# Altium schematic sheet depth sensor.SchDoc
size A4; SheetNumber: 1; SheetTotal: 1
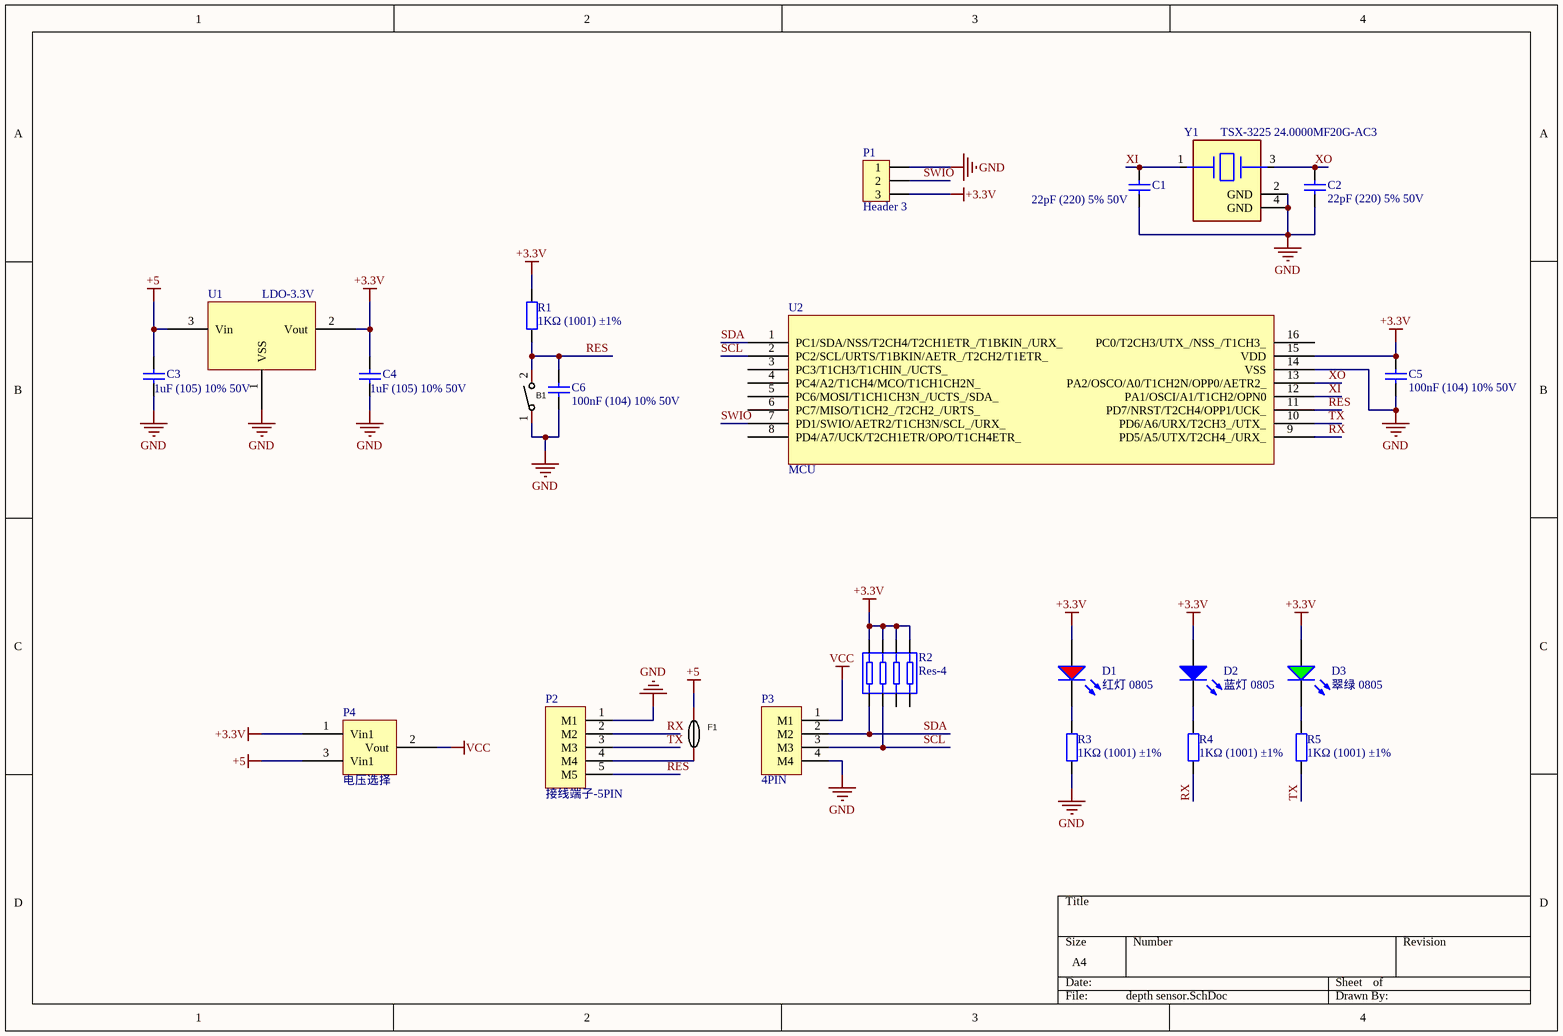
[diagram p0: depth sensor.SchDoc]

## Parts
B1  TS342A2P-WZ  [SW-SMD_L4.0-W2.9-LS5.0]  (value not drawn)
C1  22pF (220) 5% 50V  [0603_C]
C2  22pF (220) 5% 50V  [0603_C]
C3  1uF (105) 10% 50V  [0603_C]
C4  1uF (105) 10% 50V  [0603_C]
C5  100nF (104) 10% 50V  [0603_C]
C6  100nF (104) 10% 50V  [0603_C]
D1  红灯 0805  [0805_LED_S1]
D2  蓝灯 0805  [0805_LED_S1]
D3  翠绿 0805  [0805_LED_S1]
F1  SMD0805-110  [F0805]  (value not drawn)
P1  Header 3  [Header 3]
P2  接线端子-5PIN  [PH2.0-WS-5P]
P3  4PIN  [MX1.25WS-4PIN]
P4  电压选择  [change]
R1  1KΩ (1001) ±1%  [0603_R]
R2  Res-4  [res-4]
R3  1KΩ (1001) ±1%  [0603_R]
R4  1KΩ (1001) ±1%  [0603_R]
R5  1KΩ (1001) ±1%  [0603_R]
U1  LDO-3.3V  [SOT95P290X110-3N]
U2  MCU  [TSOP127P600X155-16N]
Y1  TSX-3225 24.0000MF20G-AC3  [FP-TSX-3225-MFG]

## Nets
+3.3V: C4.2 C5.2 D1.A D2.A D3.A P1.3 P4.1(Vin1) R1.2 R2.5 R2.6 R2.7 R2.8 U1.2(Vout) U2.15(VDD)
+5: C3.2 F1.2 P4.3(Vin1) U1.3(Vin)
GND: B1.1 C1.1 C2.1 C3.1 C4.1 C5.1 C6.1 P1.1 P2.1(M1) P3.4(M4) R3.1 U1.1(VSS) U2.14(VSS) Y1.2(GND) Y1.4(GND)
VCC: P3.1(M1) P4.2(Vout)
RES: B1.2 C6.2 P2.5(M5) R1.1 U2.11(PD7/NRST/T2CH4/OPP1/UCK_)
RX: P2.2(M2) R4.1 U2.9(PD5/A5/UTX/T2CH4_/URX_)
SCL: P3.3(M3) R2.2 U2.2(PC2/SCL/URTS/T1BKIN/AETR_/T2CH2/T1ETR_)
SDA: P3.2(M2) R2.1 U2.1(PC1/SDA/NSS/T2CH4/T2CH1ETR_/T1BKIN_/URX_)
SWIO: P1.2 U2.7(PD1/SWIO/AETR2/T1CH3N/SCL_/URX_)
TX: P2.3(M3) R5.1 U2.10(PD6/A6/URX/T2CH3_/UTX_)
XI: C1.2 U2.12(PA1/OSCI/A1/T1CH2/OPN0) Y1.1
XO: C2.2 U2.13(PA2/OSCO/A0/T1CH2N/OPP0/AETR2_) Y1.3
NetD1_K: D1.K R3.2
NetD2_K: D2.K R4.2
NetD3_K: D3.K R5.2
NetF1_1: F1.1 P2.4(M4)

Not connected (* = marked no-connect by the designer): R2 3 4; U2 3(PC3/T1CH3/T1CHIN_/UCTS_) 4(PC4/A2/T1CH4/MCO/T1CH1CH2N_) 5(PC6/MOSI/T1CH1CH3N_/UCTS_/SDA_) 6(PC7/MISO/T1CH2_/T2CH2_/URTS_) 8(PD4/A7/UCK/T2CH1ETR/OPO/T1CH4ETR_) 16(PC0/T2CH3/UTX_/NSS_/T1CH3_)

## Library data of the parts
B1 = TS342A2P-WZ: Manufacturer: SHOU HAN(首韩); Add into BOM: yes; Symbol: TS342A2P-WZ; Device: TS342A2P-WZ; LCSC Part Name: 轻触开关 3*4*2 两脚小龟不带柱 250gf 黑色塑胶按钮; Supplier Part: C557591; Manufacturer Part: TS342A2P-WZ; Supplier Footprint: SMD; JLCPCB Part Class: Extended Part; Datasheet: https://atta.szlcsc.com/upload/public/pdf/source/20200519/C557591_B3A5A21584733303F06306F18577DA8B.pdf; Supplier: LCSC; Convert to PCB: yes
C1 C2 = 0603 22pF (220) 5% 50V: 贴片电容; ComponentLink1Description: 供应商链接; ComponentLink1URL: http://www.szlcsc.com/product/details_2005.html; Package: 0603; Supplier: LC; SuppliersPartNumber: C1653
C3 C4 = 0603 1uF (105) 10% 50V: 贴片电容; ComponentLink1Description: 供应商链接; ComponentLink1URL: http://www.szlcsc.com/product/details_16531.html; Package: 0603; Supplier: LC; SuppliersPartNumber: C15849
C5 C6 = 0603 100nF (104) 10% 50V: 贴片电容; ComponentLink1Description: 供应商链接; ComponentLink1URL: http://www.szlcsc.com/product/details_15331.html; Package: 0603; Supplier: LC; SuppliersPartNumber: C14663
D1 = 0805 红灯: 发光二极管; ComponentLink1Description: 供应商链接; ComponentLink1URL: http://www.szlcsc.com/product/details_2668.html; Package: 0805; Supplier: LC; SuppliersPartNumber: C2295
D2 = 0805 蓝灯: 发光二极管; ComponentLink1Description: 供应商链接; ComponentLink1URL: http://www.szlcsc.com/product/details_2666.html; Package: 0805; Supplier: LC; SuppliersPartNumber: C2293
D3 = 0805 翠绿: 发光二极管; ComponentLink1Description: 供应商链接; ComponentLink1URL: http://www.szlcsc.com/product/details_2670.html; Package: 0805; Supplier: LC; SuppliersPartNumber: C2297
F1 = SMD0805-110: Manufacturer: DOWO(东沃); Symbol: SMD0805-110_C883453; Add into BOM: yes; Operating Voltage (Max): 6V; Current Rating (Max): 100A; Hold Current: 1.1A; Trip Current: 2.2A; Power Dissipation: 600mW; Resistance - Initial (Ri) (Min): 60mΩ; Resistance - Post Trip (R1) (Max): 210mΩ; Maximum Time to Trip: 0.3s; Device: SMD0805-110; LCSC Part Name: SMD0805-110; Supplier Part: C883453; Manufacturer Part: SMD0805-110; Supplier Footprint: 0805; JLCPCB Part Class: Extended Part; Datasheet: https://atta.szlcsc.com/upload/public/pdf/source/20201106/C883453_C41FA8401A960BEA648423C0D5CB40C3.pdf; Supplier: LCSC; Convert to PCB: yes; Operating Temperature: -40℃~+85℃
P1 = Header 3: 排针
P3 = 接线端子-4PIN
R1 R3-R5 = 0603 1KΩ (1001) 1%: 贴片电阻; ComponentLink1Description: 供应商链接; ComponentLink1URL: http://www.szlcsc.com/product/details_21904.html; Package: 0603; Supplier: LC; SuppliersPartNumber: C21190
R2 = Res-4: 排阻
U1 = CE6219
U2 = CH32V003A4M6
Y1 = CMP-36405-000018-1: CRYSTAL 24.0000MHZ 9PF SMD; ESR (Equivalent Series Resistance): 40R; Frequency Stability: 20ppm; Frequency: 24MHz; Tolerance: 10ppm; Drive Level: 200uW; Min Operating Temperature: -40°C; RoHS Compliant: Yes; Width: 2.5mm; Max Operating Temperature: 105°C; Package Quantity: 250; Load Capacitance: 9pF; Mount: Surface Mount; Lead Free: Lead Free; Height: 0.024inch; Depth: 2.5mm; Packaging: Tape and Reel; Series: TSX-3225; Weight: 0.000564oz; Number of Pins: 4; Termination: SMD/SMT; Case/Package: SMD/SMT; Length: 3.2mm; Frequency Tolerance: 10ppm